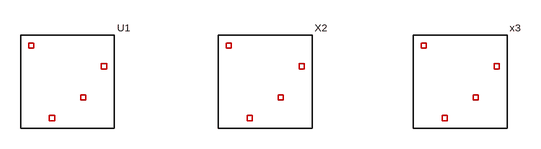
[diagram p0: schematic block_symbol.asc]
block_symbol.asc, the LTspice schematic file:
Version 4
SHEET 1 880 680
SYMBOL probe4 96 480 R0
SYMATTR InstName U1
SYMBOL probe4 400 480 R0
SYMATTR InstName X2
SYMBOL probe4 700 480 R0
SYMATTR InstName x3

The netlist it stands for:
* block_symbol.asc
XU1 NC_01 NC_02 NC_03 NC_04 probe4  ; pins a b c d
XX2 NC_05 NC_06 NC_07 NC_08 probe4  ; pins a b c d
Xx3 NC_09 NC_10 NC_11 NC_12 probe4  ; pins a b c d
.backanno
.end